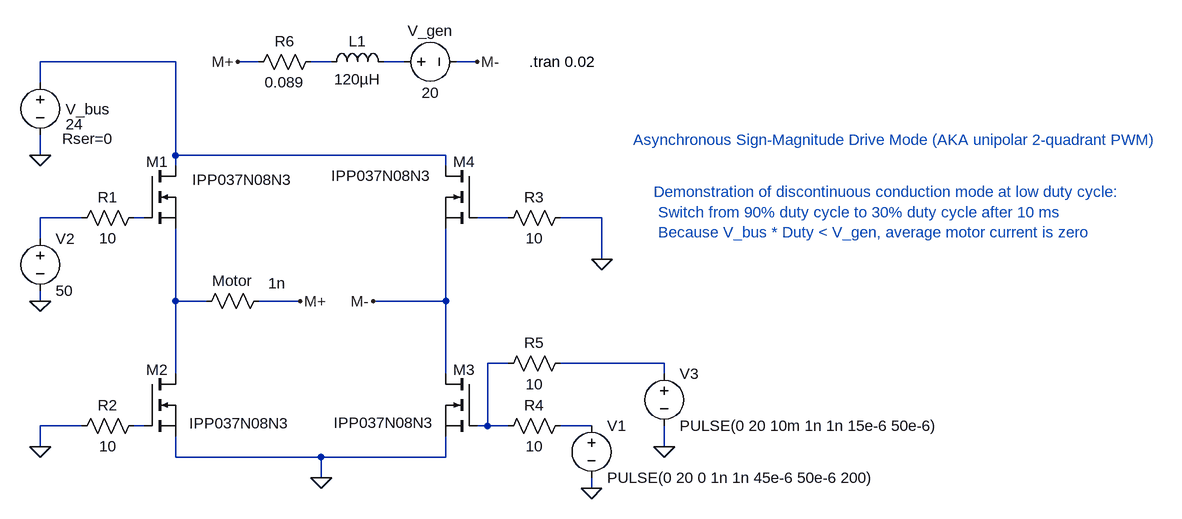
[diagram p0: schematic async_sm-discontinuous.asc]
async_sm-discontinuous.asc, the LTspice schematic file:
Version 4
SHEET 1 1820 880
WIRE 192 -368 -16 -368
WIRE 320 -368 288 -368
WIRE 432 -368 400 -368
WIRE 544 -368 512 -368
WIRE 656 -368 624 -368
WIRE -16 -336 -16 -368
WIRE -16 -224 -16 -256
WIRE 192 -224 192 -368
WIRE 608 -224 192 -224
WIRE 192 -208 192 -224
WIRE 608 -208 608 -224
WIRE 48 -128 -16 -128
WIRE 144 -128 128 -128
WIRE 704 -128 656 -128
WIRE 848 -128 784 -128
WIRE -16 -96 -16 -128
WIRE 848 -64 848 -128
WIRE -16 0 -16 -16
WIRE 192 0 192 -112
WIRE 240 0 192 0
WIRE 384 0 320 0
WIRE 608 0 608 -112
WIRE 608 0 496 0
WIRE 704 96 672 96
WIRE 944 96 784 96
WIRE 192 112 192 0
WIRE 608 112 608 0
WIRE 944 112 944 96
WIRE 48 192 -16 192
WIRE 144 192 128 192
WIRE 672 192 672 96
WIRE 672 192 656 192
WIRE 704 192 672 192
WIRE 832 192 784 192
WIRE -16 224 -16 192
WIRE 944 224 944 192
WIRE 192 240 192 208
WIRE 416 240 192 240
WIRE 608 240 608 208
WIRE 608 240 416 240
WIRE 416 272 416 240
WIRE 832 288 832 272
FLAG -16 -224 0
FLAG 416 272 0
FLAG 496 0 M-
FLAG 384 0 M+
FLAG 848 -64 0
FLAG 832 288 0
FLAG -16 0 0
FLAG -16 224 0
FLAG 944 224 0
FLAG 288 -368 M+
FLAG 656 -368 M-
SYMBOL nmos 144 -208 R0
WINDOW 0 3 -6 Left 2
WINDOW 3 74 21 Left 2
SYMATTR InstName M1
SYMATTR Value IPP037N08N3
SYMBOL voltage -16 -352 R0
WINDOW 0 39 57 Left 2
WINDOW 3 39 80 Left 2
WINDOW 123 0 0 Left 2
WINDOW 39 34 102 Left 2
SYMATTR InstName V_bus
SYMATTR Value 24
SYMATTR SpiceLine Rser=0
SYMBOL res 224 16 R270
WINDOW 0 32 56 VTop 2
WINDOW 3 59 124 VBottom 2
SYMATTR InstName Motor
SYMATTR Value 1n
SYMBOL res 144 -144 R90
WINDOW 0 0 56 VBottom 2
WINDOW 3 32 56 VTop 2
SYMATTR InstName R1
SYMATTR Value 10
SYMBOL res 144 176 R90
WINDOW 0 0 56 VBottom 2
WINDOW 3 32 56 VTop 2
SYMATTR InstName R2
SYMATTR Value 10
SYMBOL res 800 -144 R90
WINDOW 0 0 56 VBottom 2
WINDOW 3 32 56 VTop 2
SYMATTR InstName R3
SYMATTR Value 10
SYMBOL res 800 176 R90
WINDOW 0 0 56 VBottom 2
WINDOW 3 32 56 VTop 2
SYMATTR InstName R4
SYMATTR Value 10
SYMBOL nmos 144 112 R0
WINDOW 0 3 -6 Left 2
WINDOW 3 69 76 Left 2
SYMATTR InstName M2
SYMATTR Value IPP037N08N3
SYMBOL nmos 656 112 M0
WINDOW 0 3 -6 Left 2
WINDOW 3 67 75 Left 2
SYMATTR InstName M3
SYMATTR Value IPP037N08N3
SYMBOL nmos 656 -208 M0
WINDOW 0 3 -6 Left 2
WINDOW 3 71 15 Left 2
SYMATTR InstName M4
SYMATTR Value IPP037N08N3
SYMBOL voltage 832 176 R0
WINDOW 123 0 0 Left 2
WINDOW 39 0 0 Left 2
SYMATTR InstName V1
SYMATTR Value PULSE(0 20 0 1n 1n 45e-6 50e-6 200)
SYMBOL voltage -16 -112 R0
WINDOW 123 0 0 Left 2
WINDOW 39 0 0 Left 2
SYMATTR InstName V2
SYMATTR Value 50
SYMBOL res 688 112 R270
WINDOW 0 32 56 VTop 2
WINDOW 3 0 56 VBottom 2
SYMATTR InstName R5
SYMATTR Value 10
SYMBOL voltage 944 96 R0
WINDOW 123 0 0 Left 2
WINDOW 39 0 0 Left 2
SYMATTR InstName V3
SYMATTR Value PULSE(0 20 10m 1n 1n 15e-6 50e-6)
SYMBOL res 416 -384 R90
WINDOW 0 0 56 VBottom 2
WINDOW 3 32 56 VTop 2
SYMATTR InstName R6
SYMATTR Value 0.089
SYMBOL ind 416 -352 R270
WINDOW 0 32 56 VTop 2
WINDOW 3 5 56 VBottom 2
SYMATTR InstName L1
SYMATTR Value 120µH
SYMBOL voltage 528 -368 R270
WINDOW 0 32 56 VTop 2
WINDOW 3 -32 56 VBottom 2
WINDOW 123 0 0 Left 2
WINDOW 39 0 0 Left 2
SYMATTR InstName V_gen
SYMATTR Value 20
TEXT 736 -368 Left 2 !.tran 0.02
TEXT 928 -168 Left 2 ;Demonstration of discontinuous conduction mode at low duty cycle:\n Switch from 90% duty cycle to 30% duty cycle after 10 ms\n Because V_bus * Duty < V_gen, average motor current is zero
TEXT 896 -248 Left 2 ;Asynchronous Sign-Magnitude Drive Mode (AKA unipolar 2-quadrant PWM)

The netlist it stands for:
* async_sm-discontinuous.asc
M1 N001 N005 N007 N007 IPP037N08N3
V_bus N001 0 24 Rser=0
R§Motor N007 M+ 1n
R1 N005 N004 10
R2 N010 0 10
R3 0 N006 10
R4 N011 N008 10
M2 N007 N010 0 0 IPP037N08N3
M3 M- N008 0 0 IPP037N08N3
M4 N001 N006 M- M- IPP037N08N3
V1 N011 0 PULSE(0 20 0 1n 1n 45e-6 50e-6 200)
V2 N004 0 50
R5 N008 N009 10
V3 N009 0 PULSE(0 20 10m 1n 1n 15e-6 50e-6)
R6 N002 M+ 0.089
L1 N002 N003 120µH
V_gen N003 M- 20
.model NMOS NMOS
.model PMOS PMOS
.lib standard.mos
.tran 0.02
* Demonstration of discontinuous conduction mode at low duty cycle:
*  Switch from 90% duty cycle to 30% duty cycle after 10 ms
*  Because V_bus * Duty < V_gen, average motor current is zero
* Asynchronous Sign-Magnitude Drive Mode (AKA unipolar 2-quadrant PWM)
.backanno
.end